# Altium schematic sheet Sheet3.SchDoc
size A4; SheetNumber: 1; SheetTotal: 1
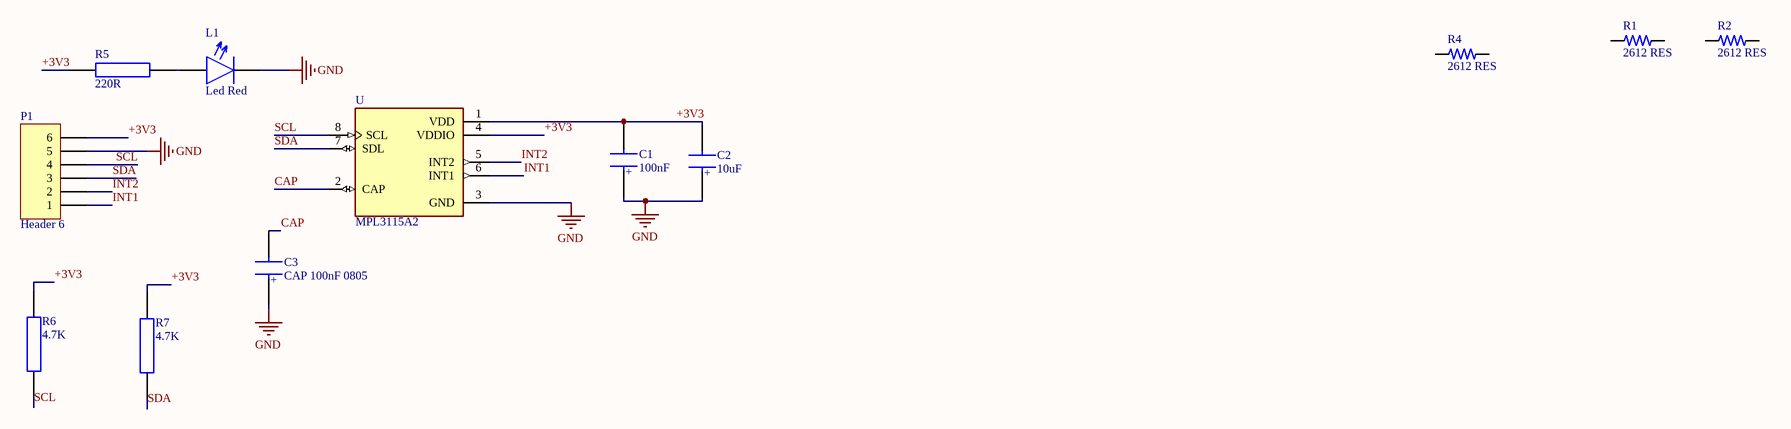
[diagram p0: Sheet3.SchDoc]

## Parts
C1  100nF  [CAP_805]
C2  10uF  [CAP_805]
C3  CAP 100nF 0805  [CAP_805]
L1  Led Red  [Led 1206]
P1  Header 6  [HDR1X6]
R1  2612 RES  [RESC6331X70N]
R2  2612 RES  [RESC6331X70N]
R4  2612 RES  [RESC6331X70N]
R5  220R  [RES_1206]
R6  4.7K  [RES_1206]
R7  4.7K  [RES_1206]
U  MPL3115A2  [PSON125P300X500X120-8N]

## Nets
GND: C1.1 C2.1 C3.1 L1.2 P1.5 U.3(GND)
+3V3: C1.2 C2.2 P1.6 R5.2 R6.2 R7.2 U.1(VDD) U.4(VDDIO)
CAP: C3.2 U.2(CAP)
INT1: P1.1 U.6(INT1)
INT2: P1.2 U.5(INT2)
SCL: P1.4 R6.1 U.8(SCL)
SDA: P1.3 R7.1 U.7(SDL)
NetL1_1: L1.1 R5.1

Not connected (* = marked no-connect by the designer): R1 1 2; R2 1 2; R4 1 2

## Notes on the sheet
- (in symbol CAP 100nF 0805) +

## Library data of the parts
C1-C3 = CAP 100nF 0805: 0805 smd
P1 = Header 6: Header, 6-Pin; LatestRevisionDate: 17-Jul-2002; LatestRevisionNote: Re-released for DXP Platform.; Publisher: Altium Limited
R1 R2 R4 = 2612 RES: CRGV2512 1% 261K 1600V; MP: 6-1879539-9; Package: None; Price: None; Value: *; Availability: Unavailable
R5-R7 = RES 4.7K 1206
U = MPL3115A2: Pressure Sensor 7.25PSI ~ 15.95PSI _50kPa ~ 110kPa_ Absolute 24 b 8-TLGA; MF: NXP USA; SnapEDA_Link: https://www.snapeda.com/parts/MPL3115A2/NXP%20USA%20Inc./view-part/472433/?ref=snap; Availability: Unavailable; MP: MPL3115A2; Price: None; Package: LGA-8 NXP USA; Value: *